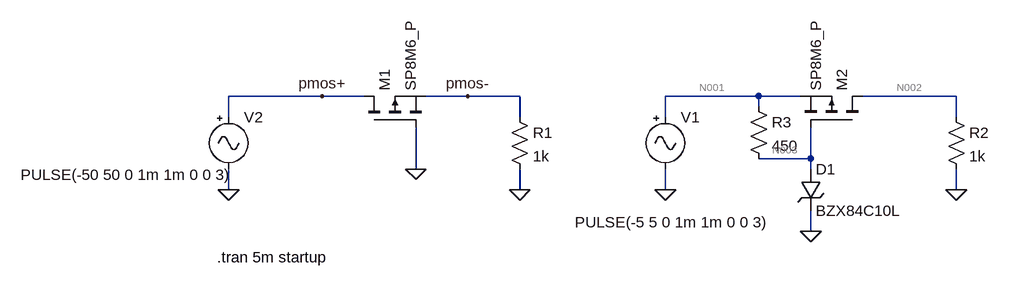
[diagram p0: schematic Draft1.asc]
Draft1.asc, the LTspice schematic file:
Version 4
SHEET 1 1096 680
WIRE 64 96 -80 96
WIRE 128 96 64 96
WIRE 288 96 224 96
WIRE 368 96 288 96
WIRE 736 96 592 96
WIRE 800 96 736 96
WIRE 1040 96 896 96
WIRE 736 112 736 96
WIRE -80 128 -80 96
WIRE 368 128 368 96
WIRE 592 128 592 96
WIRE 1040 128 1040 96
WIRE 816 192 816 144
WIRE 816 192 736 192
WIRE 208 208 208 144
WIRE 816 208 816 192
WIRE -80 240 -80 208
WIRE 368 240 368 208
WIRE 592 240 592 208
WIRE 1040 240 1040 208
WIRE 816 304 816 272
FLAG 208 208 0
FLAG 368 240 0
FLAG -80 240 0
FLAG 1040 240 0
FLAG 592 240 0
FLAG 816 304 0
FLAG 64 96 pmos+
FLAG 288 96 pmos-
SYMBOL pmos 128 144 R270
SYMATTR InstName M1
SYMATTR Value SP8M6_P
SYMBOL res 352 112 R0
SYMATTR InstName R1
SYMATTR Value 1k
SYMBOL Misc\\signal -80 112 R0
WINDOW 3 -320 105 Left 2
WINDOW 123 0 0 Left 0
WINDOW 39 0 0 Left 0
SYMATTR InstName V2
SYMATTR Value PULSE(-50 50 0 1m 1m 0 0 3)
SYMBOL pmos 896 144 M270
SYMATTR InstName M2
SYMATTR Value SP8M6_P
SYMBOL res 1024 112 R0
SYMATTR InstName R2
SYMATTR Value 1k
SYMBOL Misc\\signal 592 112 R0
WINDOW 3 -139 178 Left 2
WINDOW 123 0 0 Left 0
WINDOW 39 0 0 Left 0
SYMATTR InstName V1
SYMATTR Value PULSE(-5 5 0 1m 1m 0 0 3)
SYMBOL res 720 96 R0
SYMATTR InstName R3
SYMATTR Value 450
SYMBOL zener 800 208 R0
SYMATTR InstName D1
SYMATTR Value BZX84C10L
SYMATTR Description Diode
SYMATTR Type diode
TEXT -98 344 Left 2 !.tran 5m startup

The netlist it stands for:
* Draft1.asc
M1 pmos+ 0 pmos- pmos- SP8M6_P
R1 pmos- 0 1k
V2 pmos+ 0 PULSE(-50 50 0 1m 1m 0 0 3)
M2 N002 N003 N001 N001 SP8M6_P
R2 N002 0 1k
V1 N001 0 PULSE(-5 5 0 1m 1m 0 0 3)
R3 N001 N003 450
D1 N003 0 BZX84C10L
.model D D
.lib standard.dio
.model NMOS NMOS
.model PMOS PMOS
.lib standard.mos
.tran 5m startup
.backanno
.end

* Results of the author's LTspice run, read from the files saved beside the schematic
* Operating Point, zero values left out:
*   V(pmos+) = -50 V
*   V(pmos-) = -101.7 nV
*   V(n002) = -4.394 V
*   V(n003) = -5 V
*   V(n001) = -5 V
*   Id(M2) = 4.394 mA
*   Is(M2) = -4.394 mA
*   Id(M1) = -51.68 pA
*   Is(M1) = 51.68 pA
*   I(D1) = -605 pA
*   I(R3) = -605 pA
*   I(R2) = -4.394 mA
*   I(R1) = -101.7 pA
*   I(V1) = 4.394 mA
*   I(V2) = 101.6 pA
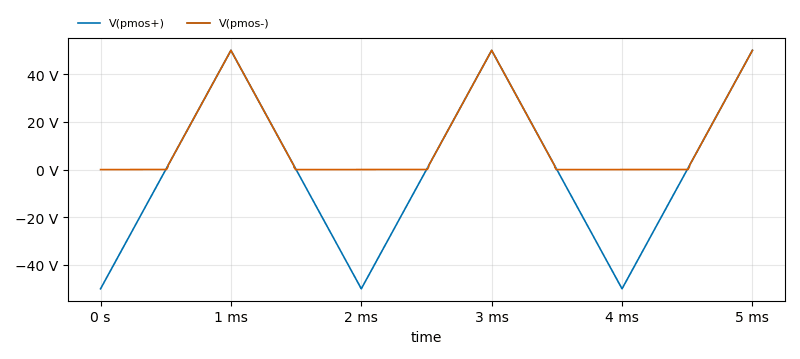
[diagram p1: Transient Analysis of Draft1.asc, plotted from the saved traces]
* Transient Analysis, 1 run:
*   V(pmos+): min -50 V, max 50 V, average 0 V, rms 29.02 V, last 50 V
*   V(pmos-): min -13.77 mV, max 50 V, average 12.49 V, rms 20.54 V, last 50 V